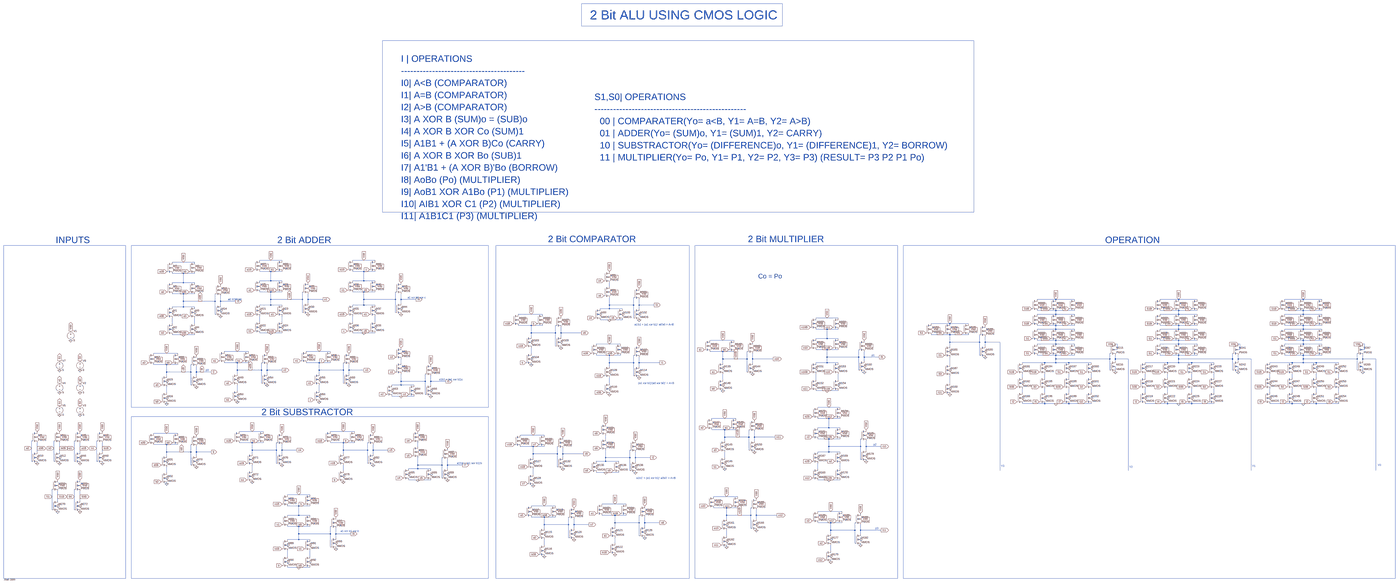
[diagram p0: schematic 2bit_alu_using_my_logic.asc, whole sheet]
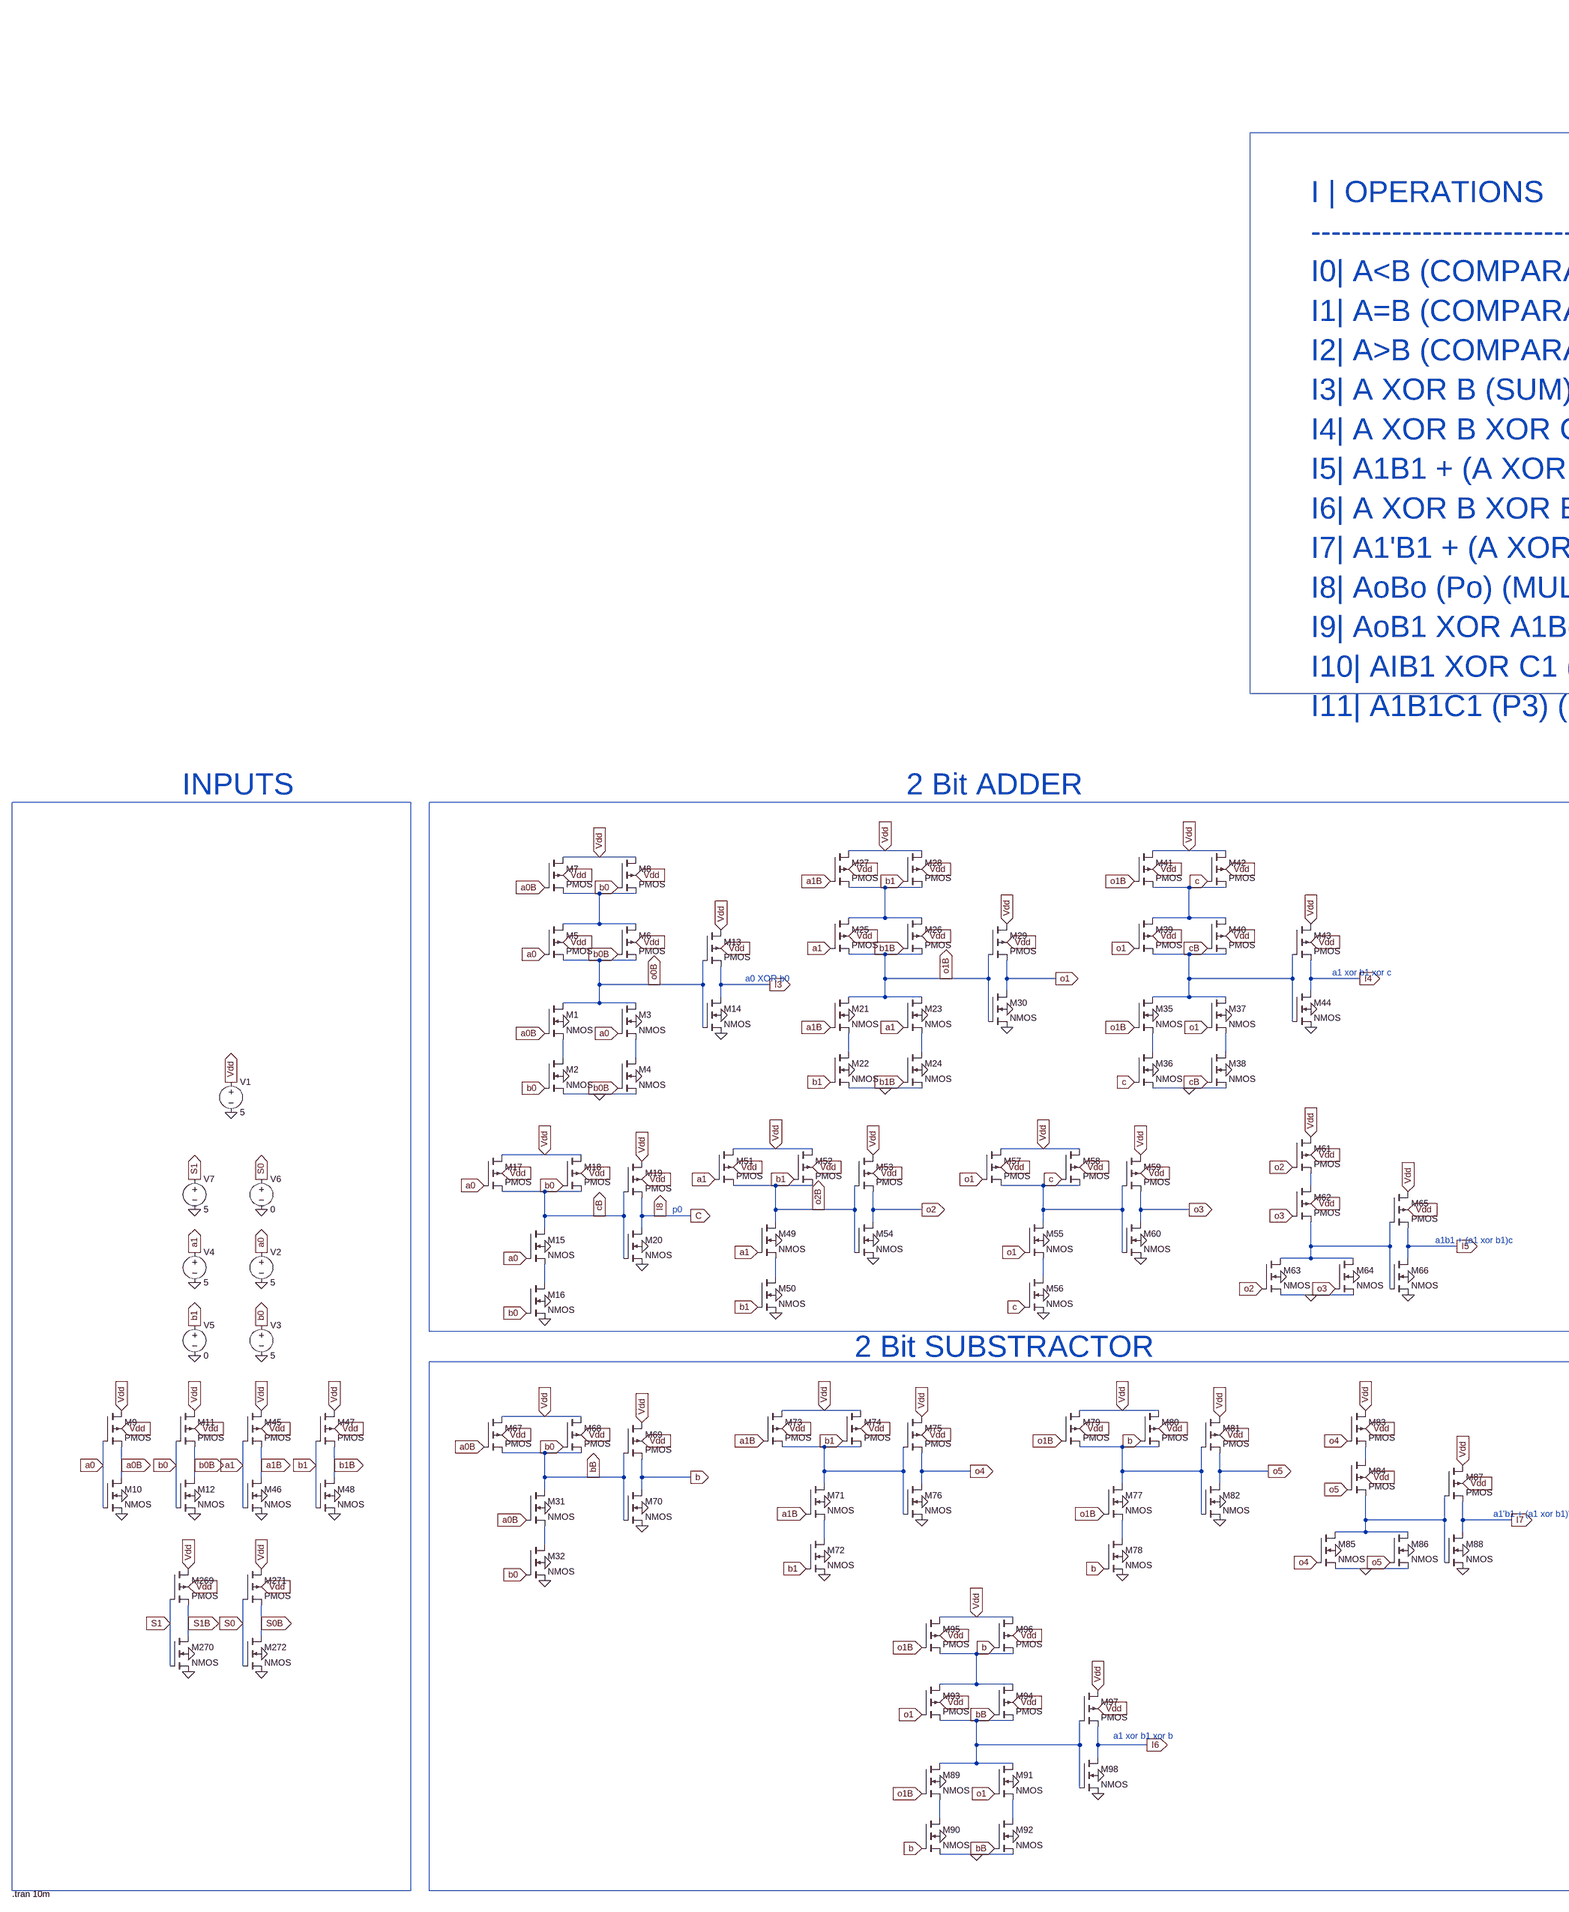
[diagram p1: schematic 2bit_alu_using_my_logic.asc, part, row 1 of 1, column 1 of 3]
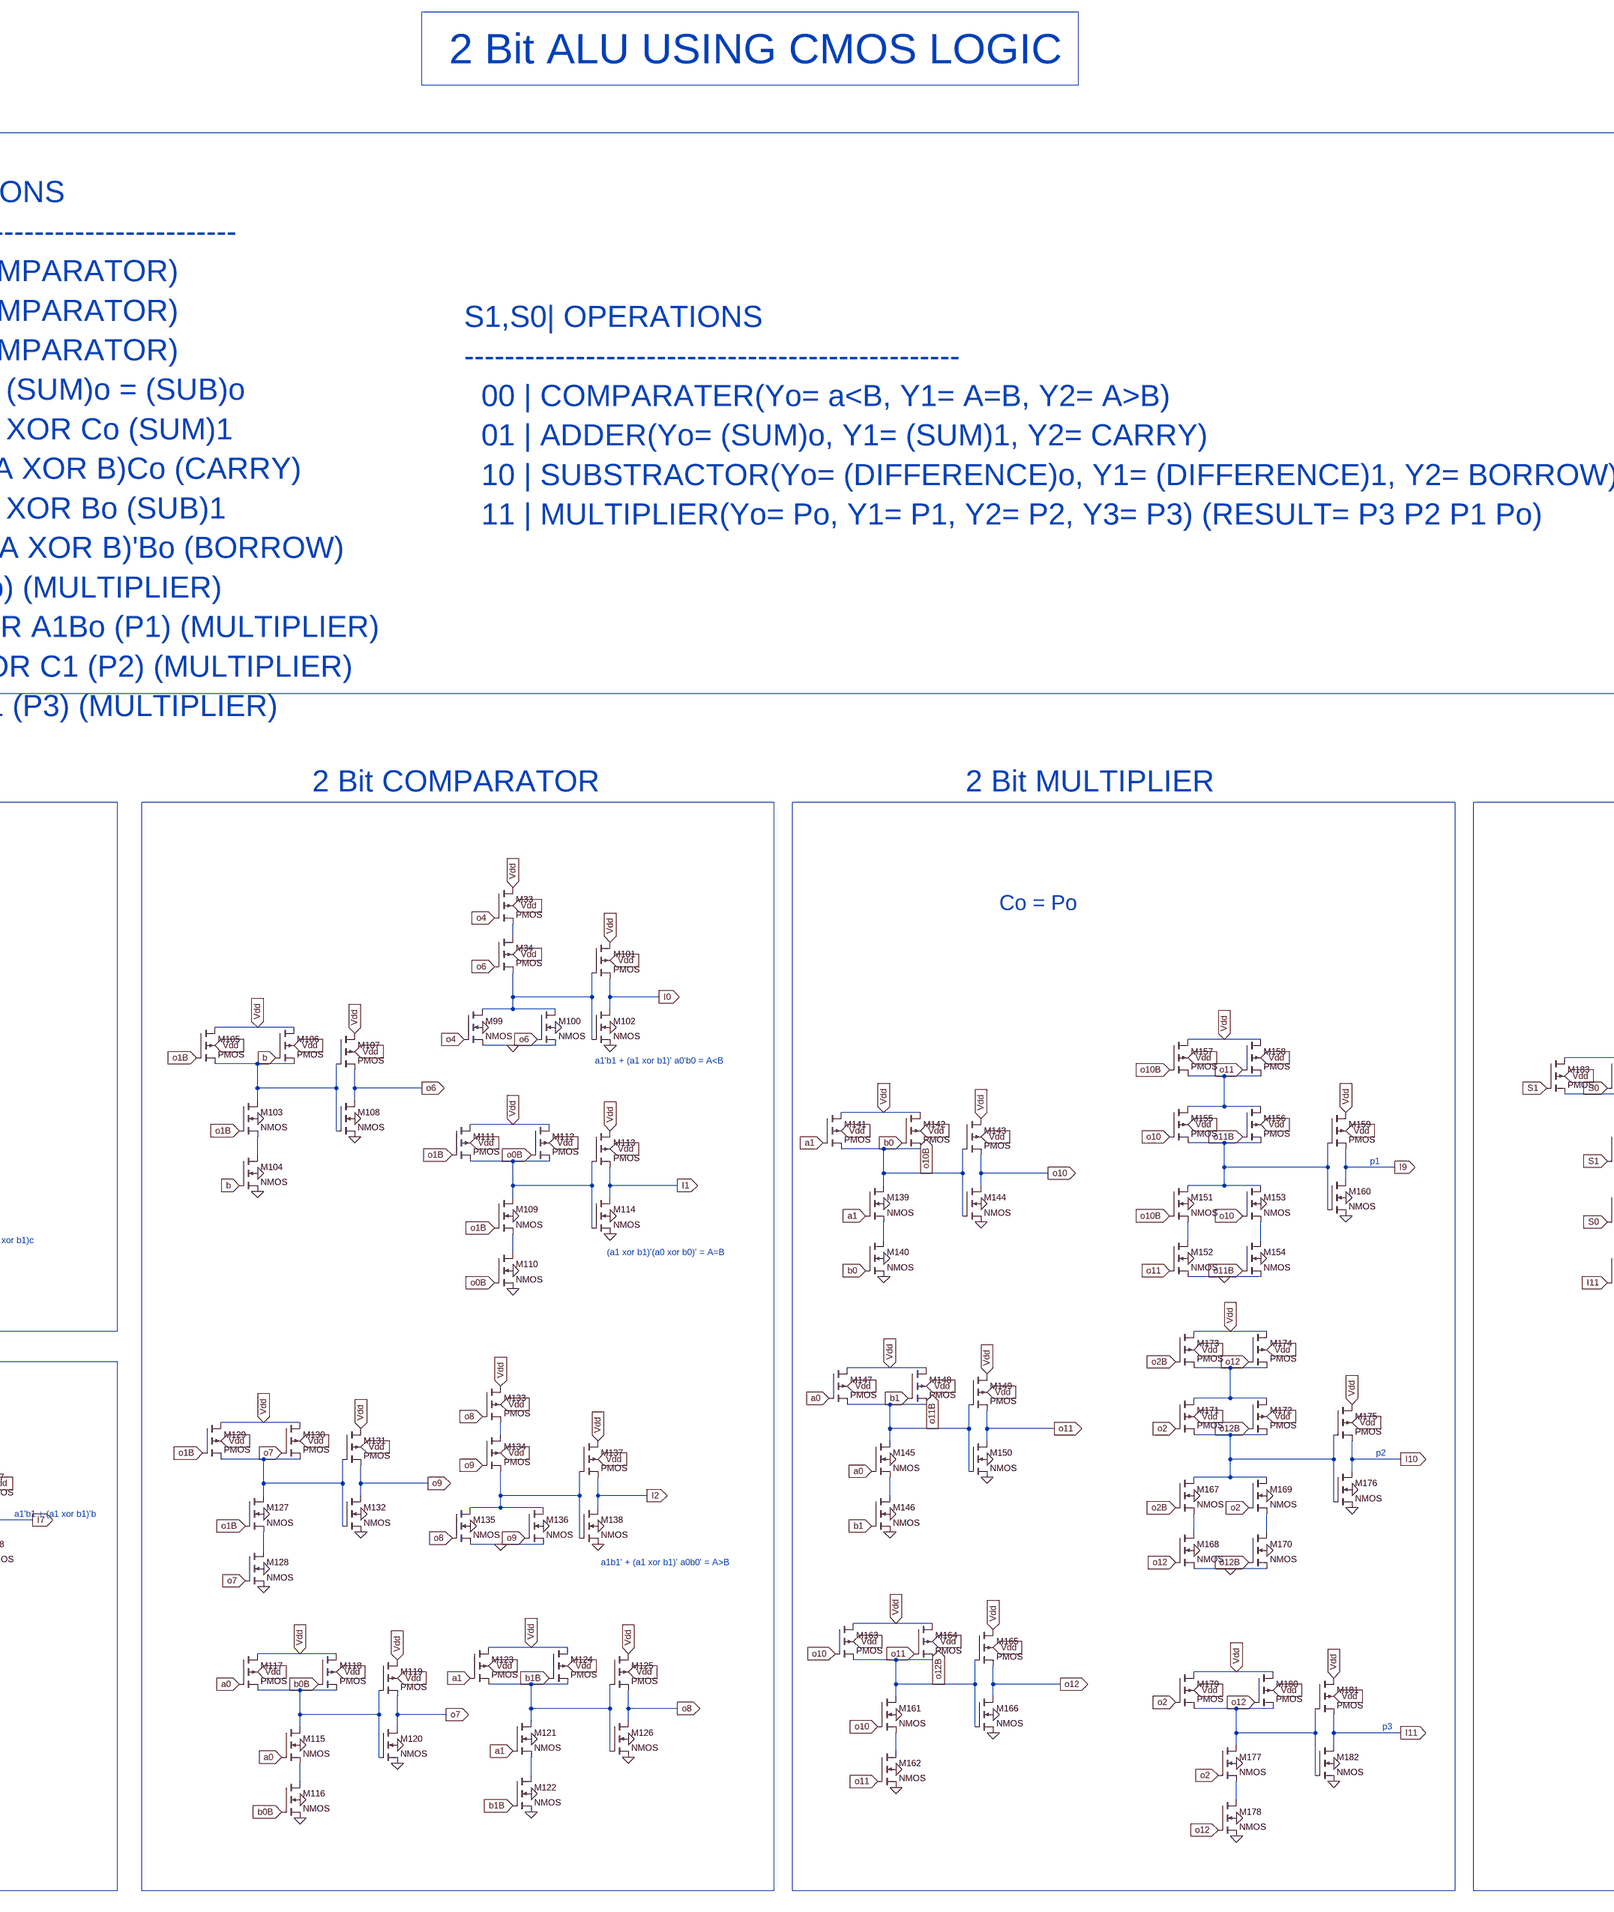
[diagram p2: schematic 2bit_alu_using_my_logic.asc, part, row 1 of 1, column 2 of 3]
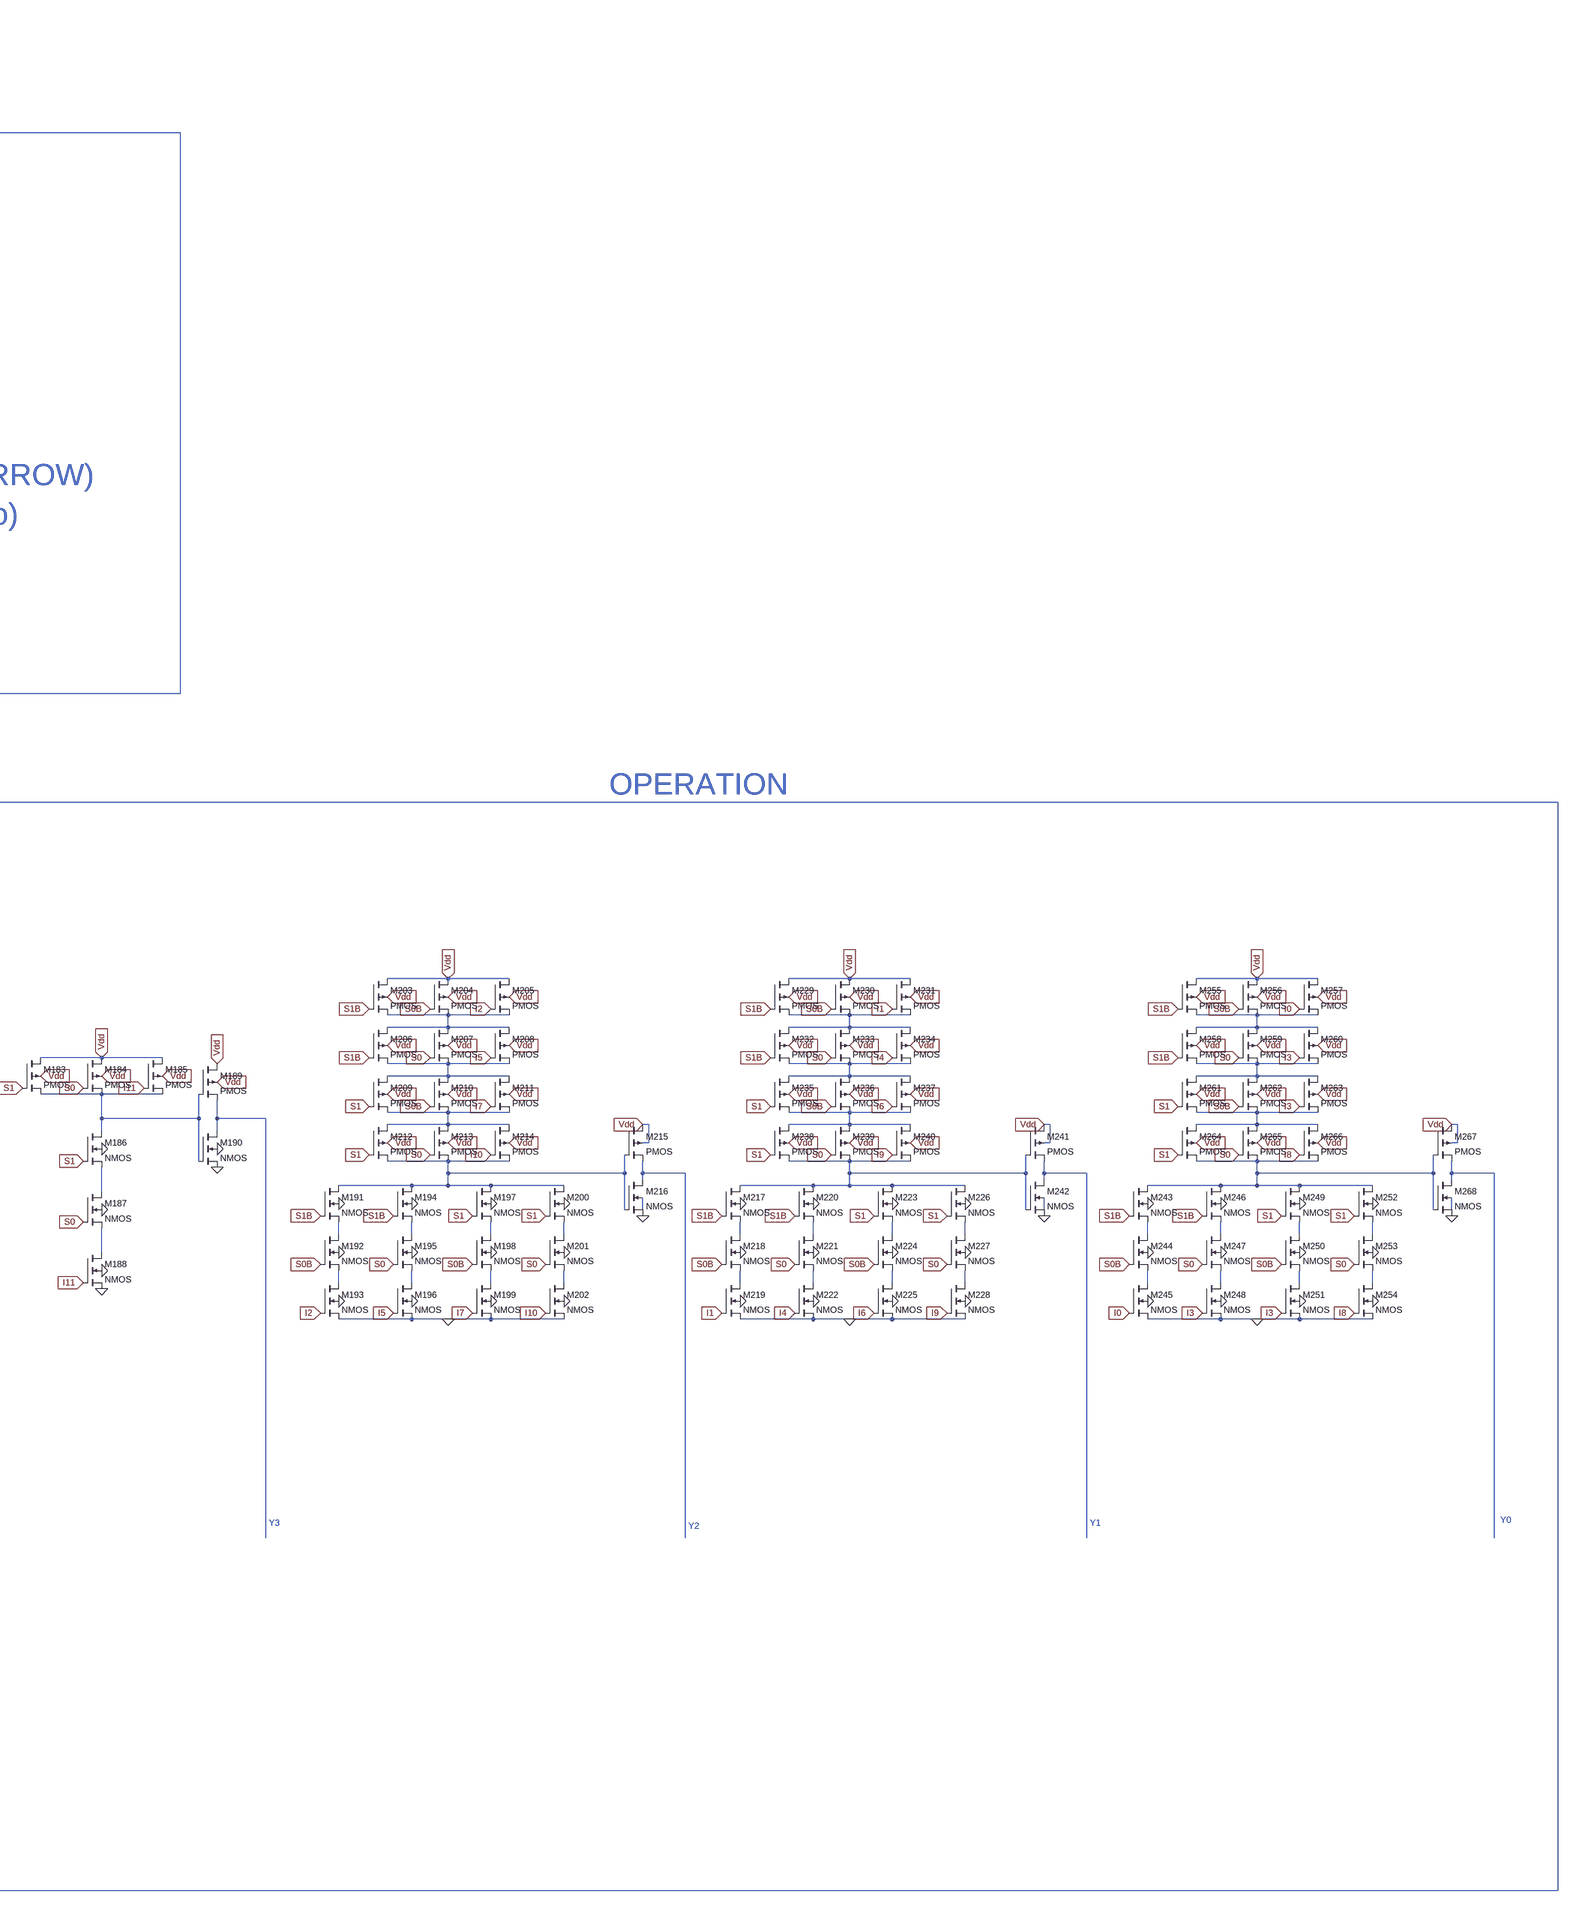
[diagram p3: schematic 2bit_alu_using_my_logic.asc, part, row 1 of 1, column 3 of 3]
* 2bit_alu_using_my_logic.asc
M1 o0B a0B N021 0 NMOS
M2 N021 b0 0 0 NMOS
M3 o0B a0 N022 0 NMOS
M4 N022 b0B 0 0 NMOS
M5 N010 a0 o0B Vdd PMOS
M6 N010 b0B o0B Vdd PMOS
M7 Vdd a0B N010 Vdd PMOS
M8 Vdd b0 N010 Vdd PMOS
V1 Vdd 0 5
V2 a0 0 5
V3 b0 0 5
M9 Vdd a0 a0B Vdd PMOS
M10 a0B a0 0 0 NMOS
M11 Vdd b0 b0B Vdd PMOS
M12 b0B b0 0 0 NMOS
M13 Vdd o0B I3 Vdd PMOS
M14 I3 o0B 0 0 NMOS
M15 cB a0 N068 0 NMOS
M16 N068 b0 0 0 NMOS
M17 Vdd a0 cB Vdd PMOS
M18 Vdd b0 cB Vdd PMOS
M19 Vdd cB I8 Vdd PMOS
M20 I8 cB 0 0 NMOS
M21 o1B a1B N017 0 NMOS
M22 N017 b1 0 0 NMOS
M23 o1B a1 N018 0 NMOS
M24 N018 b1B 0 0 NMOS
M25 N008 a1 o1B Vdd PMOS
M26 N008 b1B o1B Vdd PMOS
M27 Vdd a1B N008 Vdd PMOS
M28 Vdd b1 N008 Vdd PMOS
M29 Vdd o1B o1 Vdd PMOS
M30 o1 o1B 0 0 NMOS
M35 N012 o1B N019 0 NMOS
M36 N019 I8 0 0 NMOS
M37 N012 o1 N020 0 NMOS
M38 N020 cB 0 0 NMOS
M39 N009 o1 N012 Vdd PMOS
M40 N009 cB N012 Vdd PMOS
M41 Vdd o1B N009 Vdd PMOS
M42 Vdd I8 N009 Vdd PMOS
M43 Vdd N012 I4 Vdd PMOS
M44 I4 N012 0 0 NMOS
V4 a1 0 5
V5 b1 0 0
M45 Vdd a1 a1B Vdd PMOS
M46 a1B a1 0 0 NMOS
M47 Vdd b1 b1B Vdd PMOS
M48 b1B b1 0 0 NMOS
M49 o2B a1 N066 0 NMOS
M50 N066 b1 0 0 NMOS
M51 Vdd a1 o2B Vdd PMOS
M52 Vdd b1 o2B Vdd PMOS
M53 Vdd o2B o2 Vdd PMOS
M54 o2 o2B 0 0 NMOS
M55 N042 o1 N067 0 NMOS
M56 N067 I8 0 0 NMOS
M57 Vdd o1 N042 Vdd PMOS
M58 Vdd I8 N042 Vdd PMOS
M59 Vdd N042 o3 Vdd PMOS
M60 o3 N042 0 0 NMOS
M61 Vdd o2 N043 Vdd PMOS
M62 N043 o3 N063 Vdd PMOS
M63 N063 o2 0 0 NMOS
M64 N063 o3 0 0 NMOS
M65 Vdd N063 I5 Vdd PMOS
M66 I5 N063 0 0 NMOS
M31 bB a0B N096 0 NMOS
M32 N096 b0 0 0 NMOS
M67 Vdd a0B bB Vdd PMOS
M68 Vdd b0 bB Vdd PMOS
M69 Vdd bB b Vdd PMOS
M70 b bB 0 0 NMOS
M71 N085 a1B N094 0 NMOS
M72 N094 b1 0 0 NMOS
M73 Vdd a1B N085 Vdd PMOS
M74 Vdd b1 N085 Vdd PMOS
M75 Vdd N085 o4 Vdd PMOS
M76 o4 N085 0 0 NMOS
M77 N086 o1B N095 0 NMOS
M78 N095 b 0 0 NMOS
M79 Vdd o1B N086 Vdd PMOS
M80 Vdd b N086 Vdd PMOS
M81 Vdd N086 o5 Vdd PMOS
M82 o5 N086 0 0 NMOS
M83 Vdd o4 N087 Vdd PMOS
M84 N087 o5 N091 Vdd PMOS
M85 N091 o4 0 0 NMOS
M86 N091 o5 0 0 NMOS
M87 Vdd N091 I7 Vdd PMOS
M88 I7 N091 0 0 NMOS
M89 N102 o1B N107 0 NMOS
M90 N107 b 0 0 NMOS
M91 N102 o1 N108 0 NMOS
M92 N108 bB 0 0 NMOS
M93 N098 o1 N102 Vdd PMOS
M94 N098 bB N102 Vdd PMOS
M95 Vdd o1B N098 Vdd PMOS
M96 Vdd b N098 Vdd PMOS
M97 Vdd N102 I6 Vdd PMOS
M98 I6 N102 0 0 NMOS
M33 Vdd o4 N011 Vdd PMOS
M34 N011 o6 N013 Vdd PMOS
M99 N013 o4 0 0 NMOS
M100 N013 o6 0 0 NMOS
M101 Vdd N013 I0 Vdd PMOS
M102 I0 N013 0 0 NMOS
M103 N023 o1B N034 0 NMOS
M104 N034 b 0 0 NMOS
M105 Vdd o1B N023 Vdd PMOS
M106 Vdd b N023 Vdd PMOS
M107 Vdd N023 o6 Vdd PMOS
M108 o6 N023 0 0 NMOS
M109 N035 o1B N064 0 NMOS
M110 N064 o0B 0 0 NMOS
M111 Vdd o1B N035 Vdd PMOS
M112 Vdd o0B N035 Vdd PMOS
M113 Vdd N035 I1 Vdd PMOS
M114 I1 N035 0 0 NMOS
M115 N100 a0 N105 0 NMOS
M116 N105 b0B 0 0 NMOS
M117 Vdd a0 N100 Vdd PMOS
M118 Vdd b0B N100 Vdd PMOS
M119 Vdd N100 o7 Vdd PMOS
M120 o7 N100 0 0 NMOS
M121 N099 a1 N104 0 NMOS
M122 N104 b1B 0 0 NMOS
M123 Vdd a1 N099 Vdd PMOS
M124 Vdd b1B N099 Vdd PMOS
M125 Vdd N099 o8 Vdd PMOS
M126 o8 N099 0 0 NMOS
M127 N088 o1B N097 0 NMOS
M128 N097 o7 0 0 NMOS
M129 Vdd o1B N088 Vdd PMOS
M130 Vdd o7 N088 Vdd PMOS
M131 Vdd N088 o9 Vdd PMOS
M132 o9 N088 0 0 NMOS
M133 Vdd o8 N083 Vdd PMOS
M134 N083 o9 N089 Vdd PMOS
M135 N089 o8 0 0 NMOS
M136 N089 o9 0 0 NMOS
M137 Vdd N089 I2 Vdd PMOS
M138 I2 N089 0 0 NMOS
M139 o10B a1 N060 0 NMOS
M140 N060 b0 0 0 NMOS
M141 Vdd a1 o10B Vdd PMOS
M142 Vdd b0 o10B Vdd PMOS
M143 Vdd o10B o10 Vdd PMOS
M144 o10 o10B 0 0 NMOS
M145 o11B a0 N090 0 NMOS
M146 N090 b1 0 0 NMOS
M147 Vdd a0 o11B Vdd PMOS
M148 Vdd b1 o11B Vdd PMOS
M149 Vdd o11B o11 Vdd PMOS
M150 o11 o11B 0 0 NMOS
M151 N033 o10B N061 0 NMOS
M152 N061 o11 0 0 NMOS
M153 N033 o10 N062 0 NMOS
M154 N062 o11B 0 0 NMOS
M155 N027 o10 N033 Vdd PMOS
M156 N027 o11B N033 Vdd PMOS
M157 Vdd o10B N027 Vdd PMOS
M158 Vdd o11 N027 Vdd PMOS
M159 Vdd N033 I9 Vdd PMOS
M160 I9 N033 0 0 NMOS
M161 o12B o10 N103 0 NMOS
M162 N103 o11 0 0 NMOS
M163 Vdd o10 o12B Vdd PMOS
M164 Vdd o11 o12B Vdd PMOS
M165 Vdd o12B o12 Vdd PMOS
M166 o12 o12B 0 0 NMOS
M167 N084 o2B N092 0 NMOS
M168 N092 o12 0 0 NMOS
M169 N084 o2 N093 0 NMOS
M170 N093 o12B 0 0 NMOS
M171 N082 o2 N084 Vdd PMOS
M172 N082 o12B N084 Vdd PMOS
M173 Vdd o2B N082 Vdd PMOS
M174 Vdd o12 N082 Vdd PMOS
M175 Vdd N084 I10 Vdd PMOS
M176 I10 N084 0 0 NMOS
M177 N101 o2 N106 0 NMOS
M178 N106 o12 0 0 NMOS
M179 Vdd o2 N101 Vdd PMOS
M180 Vdd o12 N101 Vdd PMOS
M181 Vdd N101 I11 Vdd PMOS
M182 I11 N101 0 0 NMOS
M183 Vdd S1 N028 Vdd PMOS
M184 Vdd S0 N028 Vdd PMOS
M185 Vdd I11 N028 Vdd PMOS
M186 N028 S1 N044 0 NMOS
M187 N044 S0 N065 0 NMOS
M188 N065 I11 0 0 NMOS
M189 Vdd N028 N032 Vdd PMOS
M190 N032 N028 0 0 NMOS
M191 N036 S1B N048 0 NMOS
M192 N048 S0B N069 0 NMOS
M193 N069 I2 0 0 NMOS
M194 N036 S1B N049 0 NMOS
M195 N049 S0 N070 0 NMOS
M196 N070 I5 0 0 NMOS
M197 N036 S1 N050 0 NMOS
M198 N050 S0B N071 0 NMOS
M199 N071 I7 0 0 NMOS
M200 N036 S1 N051 0 NMOS
M201 N051 S0 N072 0 NMOS
M202 N072 I10 0 0 NMOS
M203 Vdd S1B N014 Vdd PMOS
M204 Vdd S0B N014 Vdd PMOS
M205 Vdd I2 N014 Vdd PMOS
M206 N014 S1B N024 Vdd PMOS
M207 N014 S0 N024 Vdd PMOS
M208 N014 I5 N024 Vdd PMOS
M209 N024 S1 N029 Vdd PMOS
M210 N024 S0B N029 Vdd PMOS
M211 N024 I7 N029 Vdd PMOS
M212 N029 S1 N036 Vdd PMOS
M213 N029 S0 N036 Vdd PMOS
M214 N029 I10 N036 Vdd PMOS
M215 Vdd N036 N039 Vdd PMOS
M216 N039 N036 0 N045 NMOS
M217 N037 S1B N052 0 NMOS
M218 N052 S0B N073 0 NMOS
M219 N073 I1 0 0 NMOS
M220 N037 S1B N053 0 NMOS
M221 N053 S0 N074 0 NMOS
M222 N074 I4 0 0 NMOS
M223 N037 S1 N054 0 NMOS
M224 N054 S0B N075 0 NMOS
M225 N075 I6 0 0 NMOS
M226 N037 S1 N055 0 NMOS
M227 N055 S0 N076 0 NMOS
M228 N076 I9 0 0 NMOS
M229 Vdd S1B N015 Vdd PMOS
M230 Vdd S0B N015 Vdd PMOS
M231 Vdd I1 N015 Vdd PMOS
M232 N015 S1B N025 Vdd PMOS
M233 N015 S0 N025 Vdd PMOS
M234 N015 I4 N025 Vdd PMOS
M235 N025 S1 N030 Vdd PMOS
M236 N025 S0B N030 Vdd PMOS
M237 N025 I6 N030 Vdd PMOS
M238 N030 S1 N037 Vdd PMOS
M239 N030 S0 N037 Vdd PMOS
M240 N030 I9 N037 Vdd PMOS
M241 Vdd N037 N040 Vdd PMOS
M242 N040 N037 0 N046 NMOS
M243 N038 S1B N056 0 NMOS
M244 N056 S0B N077 0 NMOS
M245 N077 I0 0 0 NMOS
M246 N038 S1B N057 0 NMOS
M247 N057 S0 N078 0 NMOS
M248 N078 I3 0 0 NMOS
M249 N038 S1 N058 0 NMOS
M250 N058 S0B N079 0 NMOS
M251 N079 I3 0 0 NMOS
M252 N038 S1 N059 0 NMOS
M253 N059 S0 N080 0 NMOS
M254 N080 I8 0 0 NMOS
M255 Vdd S1B N016 Vdd PMOS
M256 Vdd S0B N016 Vdd PMOS
M257 Vdd I0 N016 Vdd PMOS
M258 N016 S1B N026 Vdd PMOS
M259 N016 S0 N026 Vdd PMOS
M260 N016 I3 N026 Vdd PMOS
M261 N026 S1 N031 Vdd PMOS
M262 N026 S0B N031 Vdd PMOS
M263 N026 I3 N031 Vdd PMOS
M264 N031 S1 N038 Vdd PMOS
M265 N031 S0 N038 Vdd PMOS
M266 N031 I8 N038 Vdd PMOS
M267 Vdd N038 N041 Vdd PMOS
M268 N041 N038 0 N047 NMOS
V6 S0 0 0
V7 S1 0 5
M269 Vdd S1 S1B Vdd PMOS
M270 S1B S1 0 0 NMOS
M271 Vdd S0 S0B Vdd PMOS
M272 S0B S0 0 0 NMOS
.model NMOS NMOS
.model PMOS PMOS
.lib standard.mos
* a0 XOR b0
* a1 xor b1 xor c
* a1b1 + (a1 xor b1)c
* a1'b1 + (a1 xor b1)'b
* a1 xor b1 xor b
* a1'b1 + (a1 xor b1)' a0'b0 = A<B
* (a1 xor b1)'(a0 xor b0)' = A=B
* a1b1' + (a1 xor b1)' a0b0' = A>B
* p0
* p1
* p2
* p3
* Y0
* Y1
* Y2
* Y3
* Co = Po
* 2 Bit COMPARATOR
* 2 Bit SUBSTRACTOR
* 2 Bit ADDER
* 2 Bit MULTIPLIER
* OPERATION
* 2 Bit ALU USING CMOS LOGIC
* I | OPERATIONS
* ----------------------------------------
* I0| A<B (COMPARATOR)
* I1| A=B (COMPARATOR)
* I2| A>B (COMPARATOR)
* I3| A XOR B (SUM)o = (SUB)o
* I4| A XOR B XOR Co (SUM)1
* I5| A1B1 + (A XOR B)Co (CARRY)
* I6| A XOR B XOR Bo (SUB)1
* I7| A1'B1 + (A XOR B)'Bo (BORROW)
* I8| AoBo (Po) (MULTIPLIER)
* I9| AoB1 XOR A1Bo (P1) (MULTIPLIER)
* I10| AIB1 XOR C1 (P2) (MULTIPLIER)
* I11| A1B1C1 (P3) (MULTIPLIER)
* S1,S0| OPERATIONS
* -------------------------------------------------
*   00 | COMPARATER(Yo= a<B, Y1= A=B, Y2= A>B)
*   01 | ADDER(Yo= (SUM)o, Y1= (SUM)1, Y2= CARRY)
*   10 | SUBSTRACTOR(Yo= (DIFFERENCE)o, Y1= (DIFFERENCE)1, Y2= BORROW)
*   11 | MULTIPLIER(Yo= Po, Y1= P1, Y2= P2, Y3= P3) (RESULT= P3 P2 P1 Po)
.tran 10m
* INPUTS
.backanno
.end